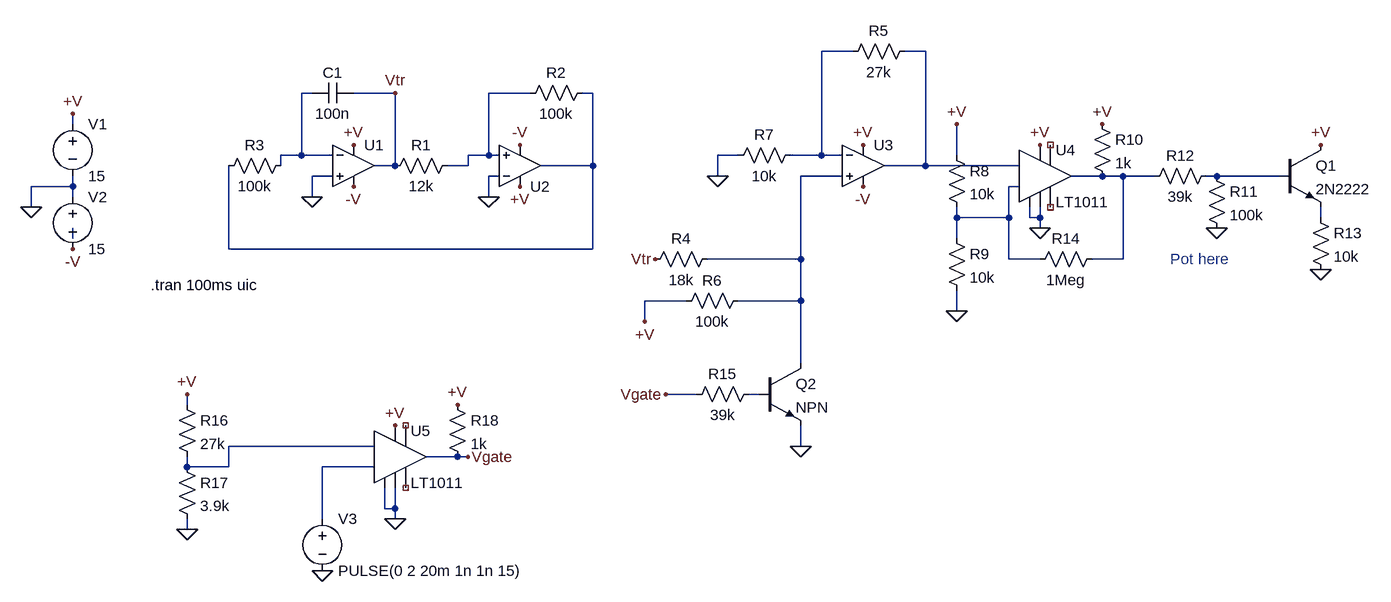
[diagram p0: schematic OscillatorFunctionGen.asc]
OscillatorFunctionGen.asc, the LTspice schematic file:
Version 4
SHEET 1 1624 804
WIRE 816 -16 768 -16
WIRE 928 -16 896 -16
WIRE -16 48 -32 48
WIRE 112 48 48 48
WIRE 320 48 256 48
WIRE 416 48 400 48
WIRE -384 96 -384 80
WIRE -32 144 -32 48
WIRE -32 144 -64 144
WIRE 16 144 -32 144
WIRE 256 144 256 48
WIRE 256 144 224 144
WIRE 272 144 256 144
WIRE 640 144 608 144
WIRE 768 144 768 -16
WIRE 768 144 720 144
WIRE 800 144 768 144
WIRE 976 144 976 96
WIRE -64 160 -64 144
WIRE 112 160 112 48
WIRE 112 160 80 160
WIRE 224 160 224 144
WIRE 224 160 192 160
WIRE 416 160 416 48
WIRE 416 160 336 160
WIRE 928 160 928 -16
WIRE 928 160 864 160
WIRE 1072 160 928 160
WIRE 16 176 -16 176
WIRE 272 176 256 176
WIRE 608 176 608 144
WIRE 800 176 736 176
WIRE 1200 176 1152 176
WIRE 1232 176 1200 176
WIRE 1280 176 1232 176
WIRE 1376 176 1360 176
WIRE 1472 176 1376 176
WIRE -384 192 -384 176
WIRE -384 192 -448 192
WIRE 1072 192 1056 192
WIRE -384 208 -384 192
WIRE -16 208 -16 176
WIRE 256 208 256 176
WIRE -448 224 -448 192
WIRE 976 240 976 224
WIRE 1056 240 1056 192
WIRE 1056 240 976 240
WIRE 1088 240 1088 224
WIRE 1104 240 1104 224
WIRE 1104 240 1088 240
WIRE 1536 240 1536 224
WIRE 1104 256 1104 240
WIRE -384 272 -384 256
WIRE 976 272 976 240
WIRE -144 288 -144 160
WIRE 416 288 416 160
WIRE 416 288 -144 288
WIRE 736 304 736 176
WIRE 736 304 592 304
WIRE 1056 304 1056 240
WIRE 1104 304 1056 304
WIRE 1232 304 1232 176
WIRE 1232 304 1184 304
WIRE 560 368 496 368
WIRE 736 368 736 304
WIRE 736 368 640 368
WIRE 976 384 976 352
WIRE 496 400 496 368
WIRE 736 464 736 368
WIRE 576 512 528 512
WIRE 672 512 656 512
WIRE -208 528 -208 512
WIRE 80 592 -144 592
WIRE 736 592 736 560
WIRE 208 608 160 608
WIRE 224 608 208 608
WIRE -208 624 -208 608
WIRE -144 624 -144 592
WIRE -144 624 -208 624
WIRE 80 624 0 624
WIRE 96 688 96 656
WIRE 112 688 112 656
WIRE 112 688 96 688
WIRE 0 704 0 624
WIRE 112 704 112 688
WIRE -208 720 -208 704
FLAG -384 80 +V
FLAG -384 288 -V
FLAG -448 224 0
FLAG 48 128 +V
FLAG 48 192 -V
FLAG 304 128 -V
FLAG 304 192 +V
FLAG 256 208 0
FLAG -16 208 0
FLAG 112 48 Vtr
FLAG 512 304 Vtr
FLAG 832 128 +V
FLAG 832 192 -V
FLAG 608 176 0
FLAG 976 384 0
FLAG 976 96 +V
FLAG 1104 128 +V
FLAG 1104 256 0
FLAG 1200 96 +V
FLAG 1376 256 0
FLAG 1536 128 +V
FLAG 1536 320 0
FLAG 112 704 0
FLAG 496 400 +V
FLAG 528 512 Vgate
FLAG 736 592 0
FLAG -208 512 +V
FLAG -208 720 0
FLAG 112 560 +V
FLAG 0 784 0
FLAG 224 608 Vgate
FLAG 208 528 +V
SYMBOL voltage -384 80 R0
WINDOW 123 0 0 Left 0
WINDOW 39 0 0 Left 0
SYMATTR InstName V1
SYMATTR Value 15
SYMBOL voltage -384 192 R0
WINDOW 123 0 0 Left 0
WINDOW 39 0 0 Left 0
SYMATTR InstName V2
SYMATTR Value 15
SYMBOL OpAmps\\UniversalOpAmp2 48 160 R0
SYMATTR InstName U1
SYMBOL OpAmps\\UniversalOpAmp2 304 160 M180
SYMATTR InstName U2
SYMBOL res 208 144 R90
WINDOW 0 0 56 VBottom 2
WINDOW 3 32 56 VTop 2
SYMATTR InstName R1
SYMATTR Value 12k
SYMBOL res 416 32 R90
WINDOW 0 0 56 VBottom 2
WINDOW 3 32 56 VTop 2
SYMATTR InstName R2
SYMATTR Value 100k
SYMBOL res -48 144 R90
WINDOW 0 0 56 VBottom 2
WINDOW 3 32 56 VTop 2
SYMATTR InstName R3
SYMATTR Value 100k
SYMBOL cap 48 32 R90
WINDOW 0 0 32 VBottom 2
WINDOW 3 32 32 VTop 2
SYMATTR InstName C1
SYMATTR Value 100n
SYMBOL OpAmps\\UniversalOpAmp2 832 160 R0
SYMATTR InstName U3
SYMBOL res 608 288 R90
WINDOW 0 0 56 VBottom 2
WINDOW 3 32 56 VTop 2
SYMATTR InstName R4
SYMATTR Value 18k
SYMBOL res 912 -32 R90
WINDOW 0 0 56 VBottom 2
WINDOW 3 32 56 VTop 2
SYMATTR InstName R5
SYMATTR Value 27k
SYMBOL res 656 352 R90
WINDOW 0 0 56 VBottom 2
WINDOW 3 32 56 VTop 2
SYMATTR InstName R6
SYMATTR Value 100k
SYMBOL res 736 128 R90
WINDOW 0 0 56 VBottom 2
WINDOW 3 32 56 VTop 2
SYMATTR InstName R7
SYMATTR Value 10k
SYMBOL Comparators\\LT1011 1104 176 R0
SYMATTR InstName U4
SYMBOL res 960 128 R0
SYMATTR InstName R8
SYMATTR Value 10k
SYMBOL res 960 256 R0
SYMATTR InstName R9
SYMATTR Value 10k
SYMBOL res 1184 80 R0
SYMATTR InstName R10
SYMATTR Value 1k
SYMBOL res 1360 160 R0
SYMATTR InstName R11
SYMATTR Value 100k
SYMBOL res 1376 160 R90
WINDOW 0 0 56 VBottom 2
WINDOW 3 32 56 VTop 2
SYMATTR InstName R12
SYMATTR Value 39k
SYMBOL npn 1472 128 R0
SYMATTR InstName Q1
SYMATTR Value 2N2222
SYMBOL res 1520 224 R0
SYMATTR InstName R13
SYMATTR Value 10k
SYMBOL res 1200 288 R90
WINDOW 0 0 56 VBottom 2
WINDOW 3 32 56 VTop 2
SYMATTR InstName R14
SYMATTR Value 1Meg
SYMBOL npn 672 464 R0
SYMATTR InstName Q2
SYMBOL Comparators\\LT1011 112 608 R0
SYMATTR InstName U5
SYMBOL res 672 496 R90
WINDOW 0 0 56 VBottom 2
WINDOW 3 32 56 VTop 2
SYMATTR InstName R15
SYMATTR Value 39k
SYMBOL res -224 512 R0
SYMATTR InstName R16
SYMATTR Value 27k
SYMBOL res -224 608 R0
SYMATTR InstName R17
SYMATTR Value 3.9k
SYMBOL voltage 0 688 R0
WINDOW 123 0 0 Left 0
WINDOW 39 0 0 Left 0
SYMATTR InstName V3
SYMATTR Value PULSE(0 2 20m 1n 1n 15)
SYMBOL res 192 512 R0
SYMATTR InstName R18
SYMATTR Value 1k
TEXT -264 344 Left 2 !.tran 100ms uic
TEXT 1304 304 Left 2 ;Pot here

The netlist it stands for:
* OscillatorFunctionGen.asc
V1 +V 0 15
V2 0 -V 15
XU1 0 N003 +V -V Vtr level2 Avol=1Meg GBW=10Meg Slew=10Meg Ilimit=25m Rail=0 Vos=0 En=0 Enk=0 In=0 Ink=0 Rin=500Meg  ; pins In+ In- V+ V- OUT
XU2 N004 0 +V -V N005 level2 Avol=1Meg GBW=10Meg Slew=10Meg Ilimit=25m Rail=0 Vos=0 En=0 Enk=0 In=0 Ink=0 Rin=500Meg  ; pins In+ In- V+ V- OUT
R1 N004 Vtr 12k
R2 N005 N004 100k
R3 N003 N005 100k
C1 Vtr N003 100n
XU3 N006 N001 +V -V N002 level2 Avol=1Meg GBW=10Meg Slew=10Meg Ilimit=25m Rail=0 Vos=0 En=0 Enk=0 In=0 Ink=0 Rin=500Meg  ; pins In+ In- V+ V- OUT
R4 N006 Vtr 18k
R5 N002 N001 27k
R6 N006 +V 100k
R7 N001 0 10k
XU4 0 N009 N002 0 NC_01 NC_02 N007 +V LT1011
R8 +V N009 10k
R9 N009 0 10k
R10 +V N007 1k
R11 N008 0 100k
R12 N008 N007 39k
Q1 +V N008 N010 0 2N2222
R13 N010 0 10k
R14 N007 N009 1Meg
Q2 N006 N012 0 0 NPN
XU5 0 N014 N013 0 NC_03 NC_04 Vgate +V LT1011
R15 N012 Vgate 39k
R16 +V N013 27k
R17 N013 0 3.9k
V3 N014 0 PULSE(0 2 20m 1n 1n 15)
R18 +V Vgate 1k
.model NPN NPN
.model PNP PNP
.lib standard.bjt
.tran 100ms uic
* Pot here
.lib UniversalOpAmp2.lib
.lib LTC1.lib
.backanno
.end